# EasyEDA Pro project ProPrj_3x3motorFPGA_2025-06-20.epro, schematic FPGA_B
Create Date: 2025-06-07; Page Name: P1; Project Name: 3x3motorFPGA; Schematic Name: FPGA_B; Update Date: 2025-06-07; Company: EasyEDA.com; Page Size: A4; Version: V1.0
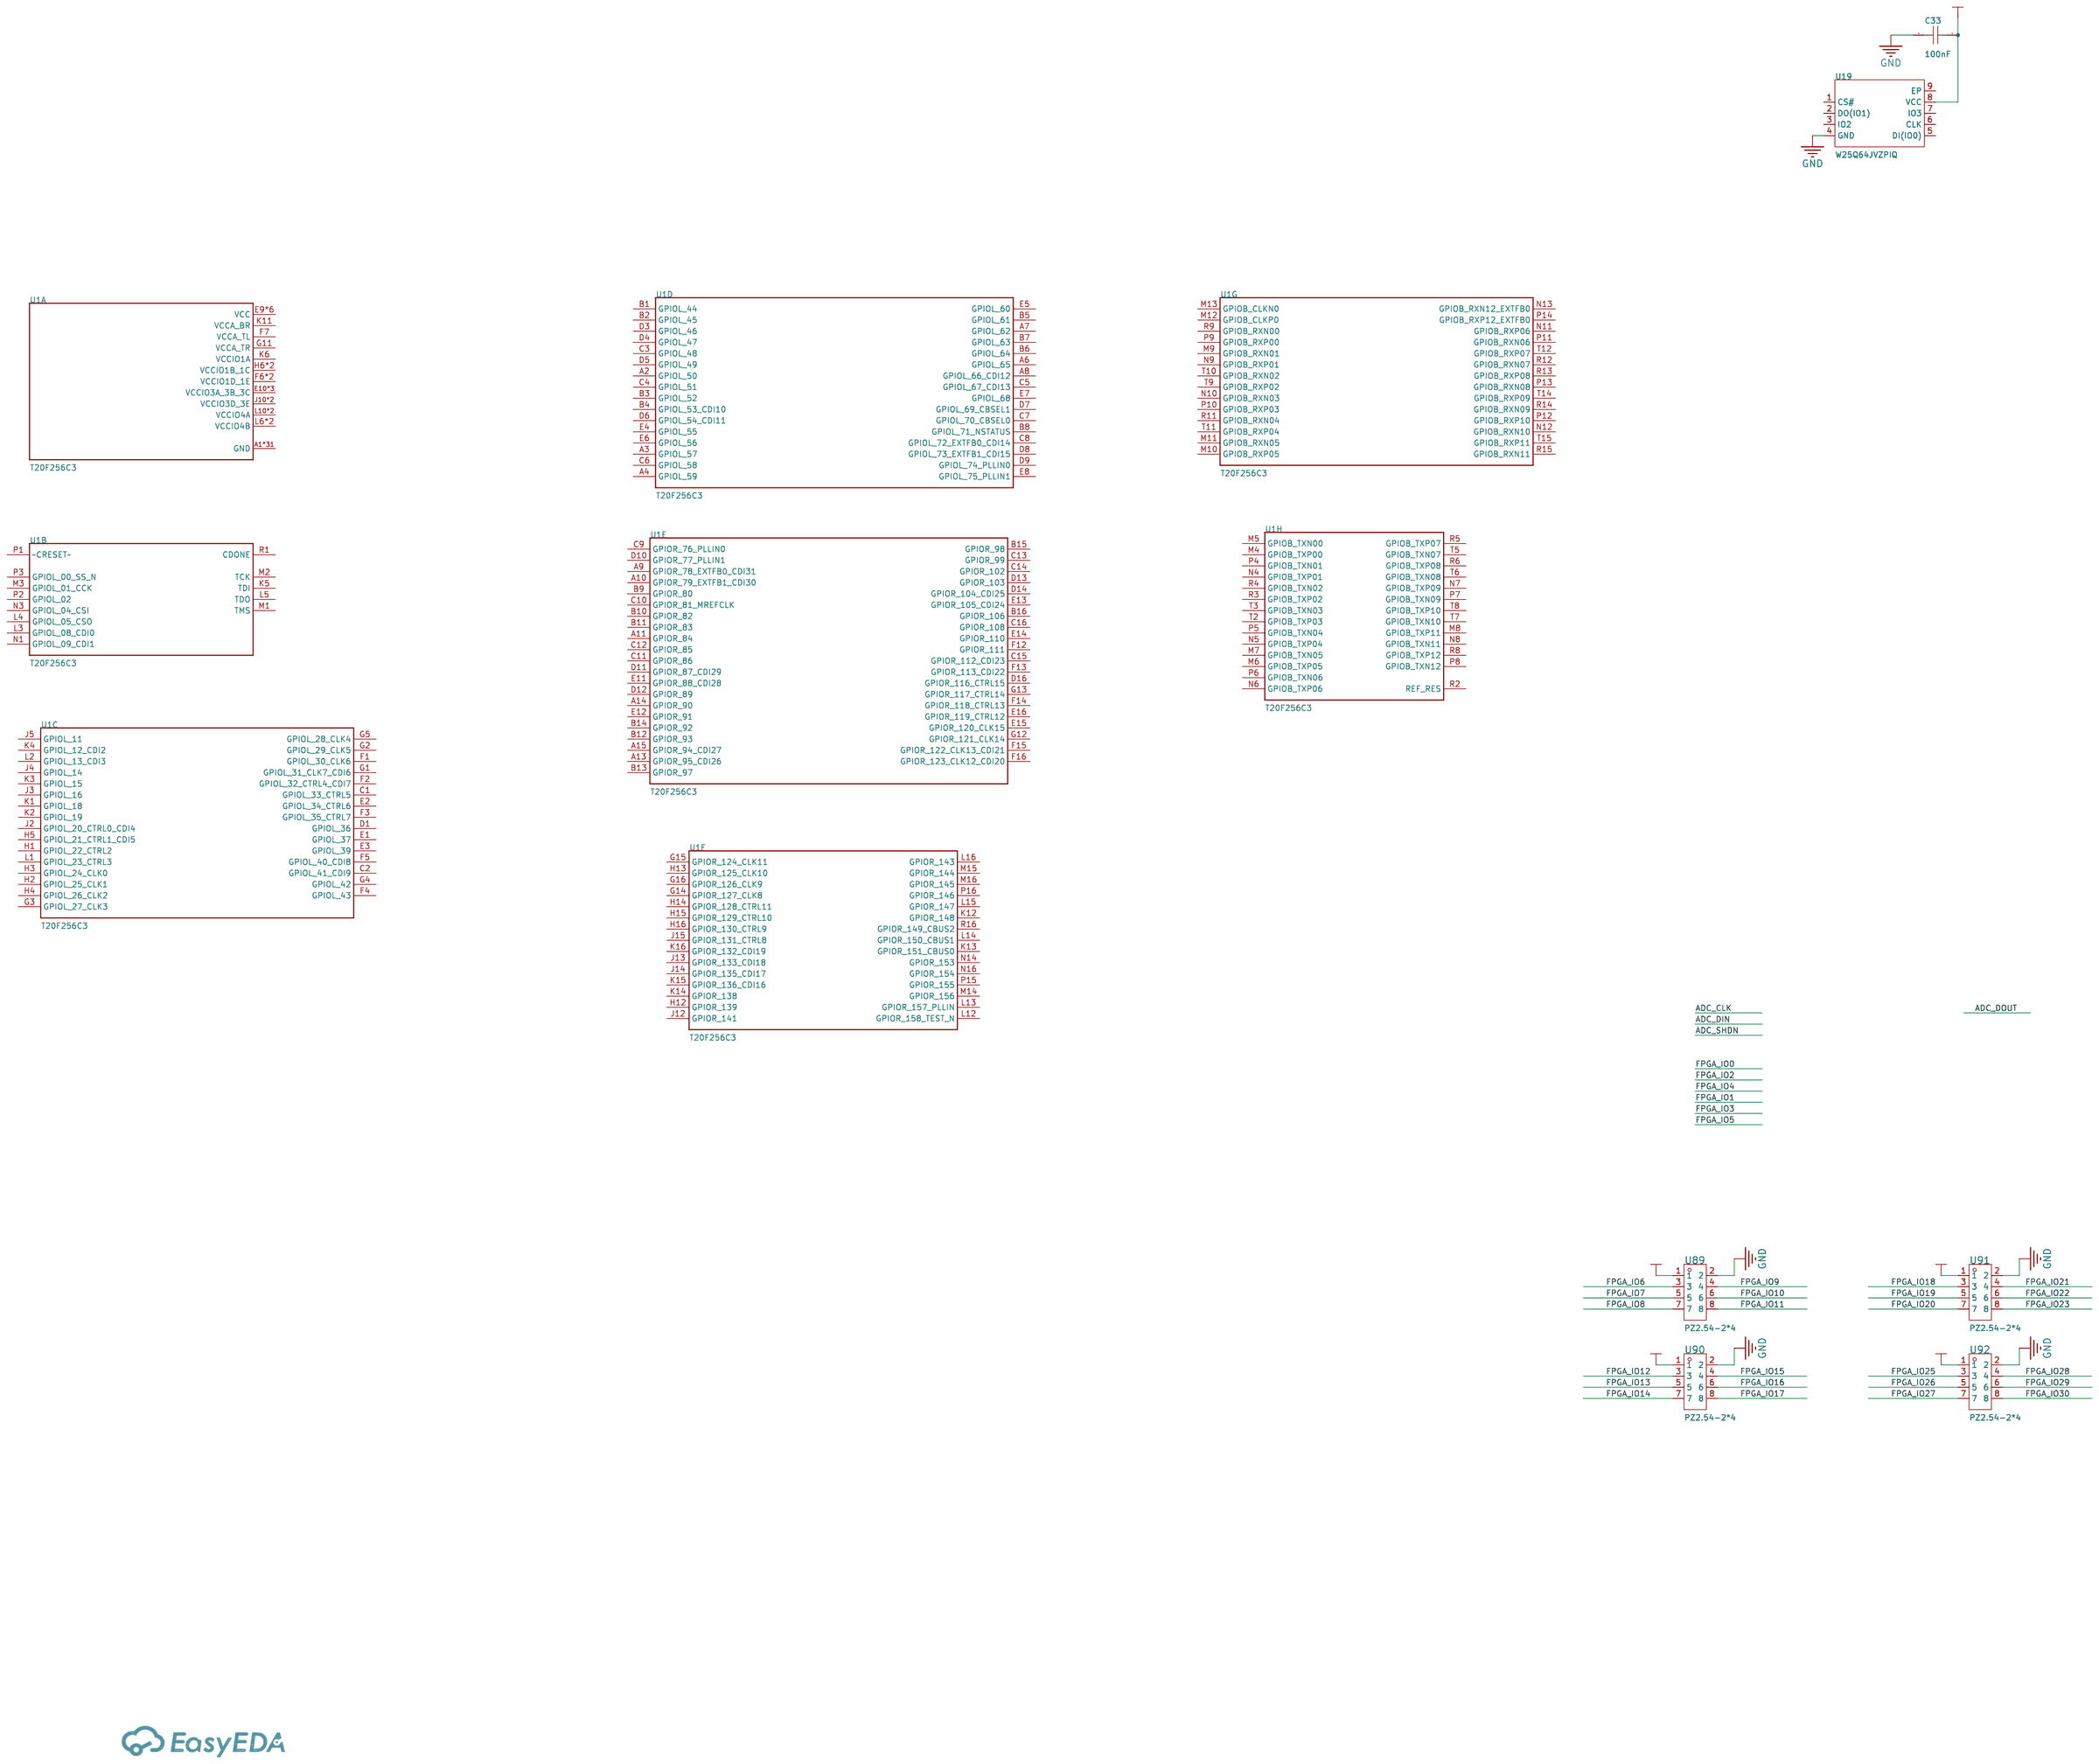
[diagram p3: schematic sheet]

## Parts
?#3  -
C33  100nF  [C0402]
U1  T20F256C3  [BGA256C80P16X16_1300X1300X120N]  (sections G$1,G$2,G$3,G$4,G$5,G$6,G$7,G$8)
U19  W25Q64JVZPIQ  [WSON-8_L6.0-W5.0-P1.27-BL-EP]
U89  PZ2.54-2*4  [HDR-TH_8P-P2.54-V-M-R2-C4-S2.54]
U90  PZ2.54-2*4  [HDR-TH_8P-P2.54-V-M-R2-C4-S2.54]
U91  PZ2.54-2*4  [HDR-TH_8P-P2.54-V-M-R2-C4-S2.54]
U92  PZ2.54-2*4  [HDR-TH_8P-P2.54-V-M-R2-C4-S2.54]

## Library data of the parts
C33 = CL05B104KB54PNC: Capacitance: Tolerance:±10% Tolerance:±10% Voltage Rated: Temperature Coefficient:; LCSC Part Name: 100nF ±10% 50V; Supplier Part: C307331; Manufacturer: SAMSUNG(三星); Supplier Footprint: 0402; JLCPCB Part Class: Basic Part; Datasheet: https://atta.szlcsc.com/upload/public/pdf/source/20160218/1457707763339.pdf; Supplier: LCSC; Tolerance: ±10%; Check: true
U1 = T20F256C3
U19 = W25Q64JVZPIQ: Interface Type:SPI Memory Size:64Mbit Clock Frequency (fc):133MHz Supply Voltage:2.7V~3.6V Supply Voltage:2.7V~3.6V Page Programming Time (Tpp):400us Block Erase Time (tBE):120ms@(32KB) Data Retention - TDR (Year):20 years Operating Temperature:-40℃~+85℃; Supplier Part: C2940197; Manufacturer: WINBOND(华邦); Supplier Footprint: WSON-8-EP(5x6); JLCPCB Part Class: Extended Part; Datasheet: https://atta.szlcsc.com/upload/public/pdf/source/20220111/96C134BA110DAC08742B3CB6C4519B4C.pdf; Supplier: LCSC; Interface Type: SPI; Memory Size: 64Mbit; Clock Frequency (fc): 133MHz; Supply Voltage: 2.7V~3.6V; Page Programming Time (Tpp): 400us; Block Erase Time (tBE): 120ms@(32KB); Data Retention - TDR (Year): 20 years; Operating Temperature: -40℃~+85℃; Check: true
U89-U92 = PZ2.54-2*4: Pin Structure:2x4P Pitch:2.54mm Number of Rows:双排 Number of Pins:8P; Supplier Part: C5156676; Manufacturer: ZHOURI(洲日); Supplier Footprint: 插件,P=2.54mm; JLCPCB Part Class: Extended Part; Datasheet: https://atta.szlcsc.com/upload/public/pdf/source/20220923/0E7A4A94740FFD503E2D73F36F92C1EA.pdf; Supplier: LCSC; Pin Structure: 2x4P; Pitch: 2.54mm; Number of Rows: 双排; Number of Pins: 8P; Check: true

## Nets
3.3V: C33.1 U19.8(VCC) U89.1 U90.1 U91.1 U92.1
GND: C33.2 U19.4(GND) U89.2 U90.2 U91.2 U92.2
ADC_CLK: ?#3.(FPGA_IO5)
FPGA_IO6: U89.3
FPGA_IO7: U89.5
FPGA_IO8: U89.7
FPGA_IO9: U89.4
FPGA_IO10: U89.6
FPGA_IO11: U89.8
FPGA_IO12: U90.3
FPGA_IO13: U90.5
FPGA_IO14: U90.7
FPGA_IO15: U90.4
FPGA_IO16: U90.6
FPGA_IO17: U90.8
FPGA_IO18: U91.3
FPGA_IO19: U91.5
FPGA_IO20: U91.7
FPGA_IO21: U91.4
FPGA_IO22: U91.6
FPGA_IO23: U91.8
FPGA_IO25: U92.3
FPGA_IO26: U92.5
FPGA_IO27: U92.7
FPGA_IO28: U92.4
FPGA_IO29: U92.6
FPGA_IO30: U92.8

Not connected (* = marked no-connect by the designer): U1 A1*31(GND) A2(GPIOL_50) A3(GPIOL_57) A4(GPIOL_59) A6(GPIOL_65) A7(GPIOL_62) A8(GPIOL_66_CDI12) A9(GPIOR_78_EXTFB0_CDI31) A10(GPIOR_79_EXTFB1_CDI30) A11(GPIOR_84) A13(GPIOR_95_CDI26) A14(GPIOR_90) A15(GPIOR_94_CDI27) B1(GPIOL_44) B2(GPIOL_45) B3(GPIOL_52) B4(GPIOL_53_CDI10) B5(GPIOL_61) B6(GPIOL_64) B7(GPIOL_63) B8(GPIOL_71_NSTATUS) B9(GPIOR_80) B10(GPIOR_82) B11(GPIOR_83) B12(GPIOR_93) B13(GPIOR_97) B14(GPIOR_92) B15(GPIOR_98) B16(GPIOR_106) C1(GPIOL_33_CTRL5) C2(GPIOL_41_CDI9) C3(GPIOL_48) C4(GPIOL_51) C5(GPIOL_67_CDI13) C6(GPIOL_58) C7(GPIOL_70_CBSEL0) C8(GPIOL_72_EXTFB0_CDI14) C9(GPIOR_76_PLLIN0) C10(GPIOR_81_MREFCLK) C11(GPIOR_86) C12(GPIOR_85) C13(GPIOR_99) C14(GPIOR_102) C15(GPIOR_112_CDI23) C16(GPIOR_108) D1(GPIOL_36) D3(GPIOL_46) D4(GPIOL_47) D5(GPIOL_49) D6(GPIOL_54_CDI11) D7(GPIOL_69_CBSEL1) D8(GPIOL_73_EXTFB1_CDI15) D9(GPIOL_74_PLLIN0) D10(GPIOR_77_PLLIN1) D11(GPIOR_87_CDI29) D12(GPIOR_89) D13(GPIOR_103) D14(GPIOR_104_CDI25) D16(GPIOR_116_CTRL15) E1(GPIOL_37) E2(GPIOL_34_CTRL6) E3(GPIOL_39) E4(GPIOL_55) E5(GPIOL_60) E6(GPIOL_56) E7(GPIOL_68) E8(GPIOL_75_PLLIN1) E9*6(VCC) E10*3(VCCIO3A_3B_3C) E11(GPIOR_88_CDI28) E12(GPIOR_91) E13(GPIOR_105_CDI24) E14(GPIOR_110) E15(GPIOR_120_CLK15) E16(GPIOR_119_CTRL12) F1(GPIOL_30_CLK6) F2(GPIOL_32_CTRL4_CDI7) F3(GPIOL_35_CTRL7) F4(GPIOL_43) F5(GPIOL_40_CDI8) F6*2(VCCIO1D_1E) F7(VCCA_TL) F12(GPIOR_111) F13(GPIOR_113_CDI22) F14(GPIOR_118_CTRL13) F15(GPIOR_122_CLK13_CDI21) F16(GPIOR_123_CLK12_CDI20) G1(GPIOL_31_CLK7_CDI6) G2(GPIOL_29_CLK5) G3(GPIOL_27_CLK3) G4(GPIOL_42) G5(GPIOL_28_CLK4) G11(VCCA_TR) G12(GPIOR_121_CLK14) G13(GPIOR_117_CTRL14) G14(GPIOR_127_CLK8) G15(GPIOR_124_CLK11) G16(GPIOR_126_CLK9) H1(GPIOL_22_CTRL2) H2(GPIOL_25_CLK1) H3(GPIOL_24_CLK0) H4(GPIOL_26_CLK2) H5(GPIOL_21_CTRL1_CDI5) H6*2(VCCIO1B_1C) H12(GPIOR_139) H13(GPIOR_125_CLK10) H14(GPIOR_128_CTRL11) H15(GPIOR_129_CTRL10) H16(GPIOR_130_CTRL9) J2(GPIOL_20_CTRL0_CDI4) J3(GPIOL_16) J4(GPIOL_14) J5(GPIOL_11) J10*2(VCCIO3D_3E) J12(GPIOR_141) J13(GPIOR_133_CDI18) J14(GPIOR_135_CDI17) J15(GPIOR_131_CTRL8) K1(GPIOL_18) K2(GPIOL_19) K3(GPIOL_15) K4(GPIOL_12_CDI2) K5(TDI) K6(VCCIO1A) K11(VCCA_BR) K12(GPIOR_148) K13(GPIOR_151_CBUS0) K14(GPIOR_138) K15(GPIOR_136_CDI16) K16(GPIOR_132_CDI19) L1(GPIOL_23_CTRL3) L2(GPIOL_13_CDI3) L3(GPIOL_08_CDI0) L4(GPIOL_05_CSO) L5(TDO) L6*2(VCCIO4B) L10*2(VCCIO4A) L12(GPIOR_158_TEST_N) L13(GPIOR_157_PLLIN) L14(GPIOR_150_CBUS1) L15(GPIOR_147) L16(GPIOR_143) M1(TMS) M2(TCK) M3(GPIOL_01_CCK) M4(GPIOB_TXP00) M5(GPIOB_TXN00) M6(GPIOB_TXP05) M7(GPIOB_TXN05) M8(GPIOB_TXP11) M9(GPIOB_RXN01) M10(GPIOB_RXP05) M11(GPIOB_RXN05) M12(GPIOB_CLKP0) M13(GPIOB_CLKN0) M14(GPIOR_156) M15(GPIOR_144) M16(GPIOR_145) N1(GPIOL_09_CDI1) N3(GPIOL_04_CSI) N4(GPIOB_TXP01) N5(GPIOB_TXP04) N6(GPIOB_TXP06) N7(GPIOB_TXP09) N8(GPIOB_TXN11) N9(GPIOB_RXP01) N10(GPIOB_RXN03) N11(GPIOB_RXP06) N12(GPIOB_RXN10) N13(GPIOB_RXN12_EXTFB0) N14(GPIOR_153) N16(GPIOR_154) P1(~CRESET~) P2(GPIOL_02) P3(GPIOL_00_SS_N) P4(GPIOB_TXN01) P5(GPIOB_TXN04) P6(GPIOB_TXN06) P7(GPIOB_TXN09) P8(GPIOB_TXN12) P9(GPIOB_RXP00) P10(GPIOB_RXP03) P11(GPIOB_RXN06) P12(GPIOB_RXP10) P13(GPIOB_RXN08) P14(GPIOB_RXP12_EXTFB0) P15(GPIOR_155) P16(GPIOR_146) R1(CDONE) R2(REF_RES) R3(GPIOB_TXP02) R4(GPIOB_TXN02) R5(GPIOB_TXP07) R6(GPIOB_TXP08) R8(GPIOB_TXP12) R9(GPIOB_RXN00) R11(GPIOB_RXN04) R12(GPIOB_RXN07) R13(GPIOB_RXP08) R14(GPIOB_RXN09) R15(GPIOB_RXN11) R16(GPIOR_149_CBUS2) T2(GPIOB_TXP03) T3(GPIOB_TXN03) T5(GPIOB_TXN07) T6(GPIOB_TXN08) T7(GPIOB_TXN10) T8(GPIOB_TXP10) T9(GPIOB_RXP02) T10(GPIOB_RXN02) T11(GPIOB_RXP04) T12(GPIOB_RXP07) T14(GPIOB_RXP09) T15(GPIOB_RXP11); U19 1(CS#) 2(DO(IO1)) 3(IO2) 5(DI(IO0)) 6(CLK) 7(IO3) 9(EP)
